# EAGLE design firstTestUno (EAGLE 9.1.3)
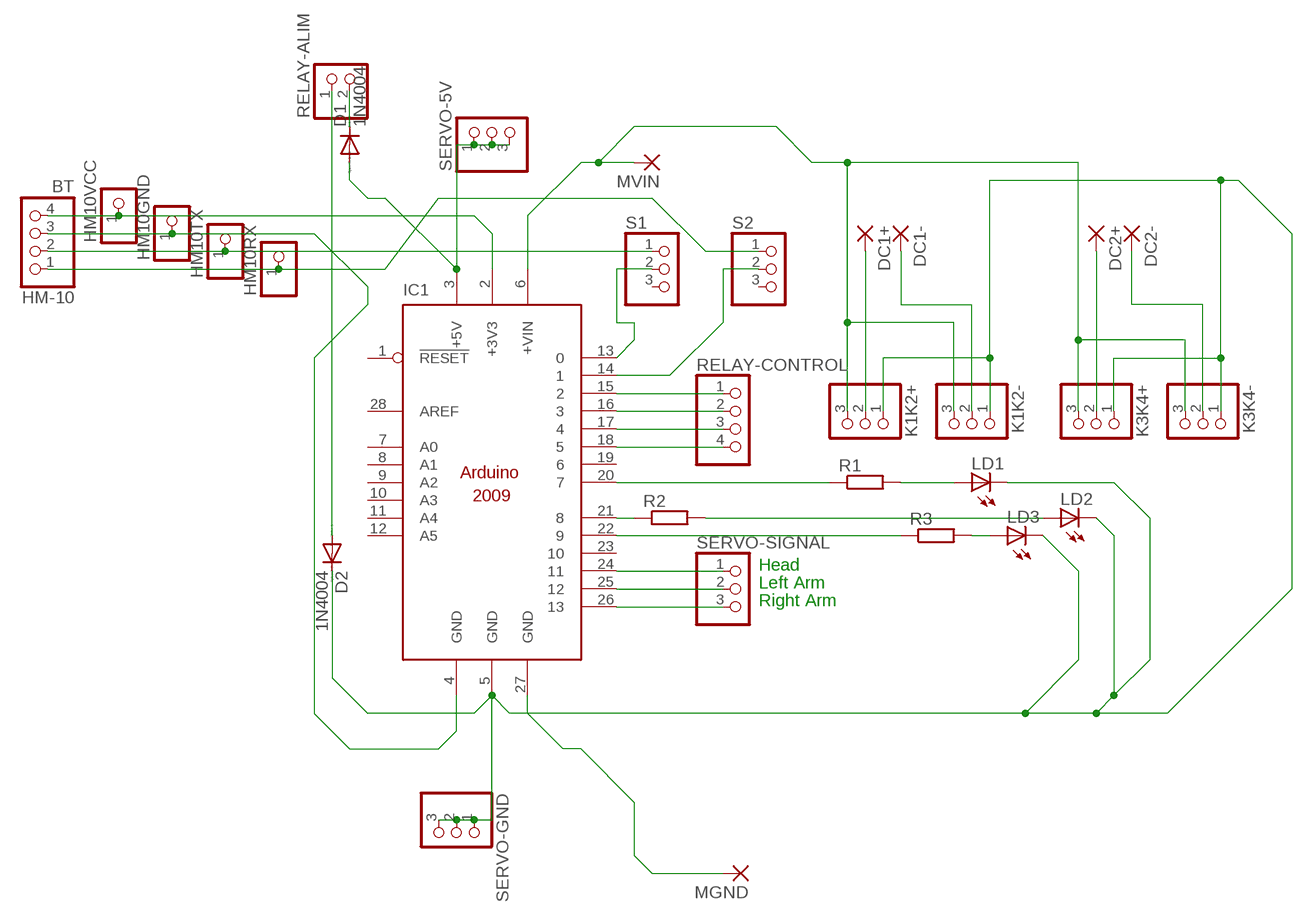
[diagram p0: schematic, sheet 1]

## Parts
D1  1N4004  [DO41-10]
D2  1N4004  [DO41-10]
DC1+  3,17/1,3  [3,17/1,3]
DC1-  3,17/1,3  [3,17/1,3]
DC2+  3,17/1,3  [3,17/1,3]
DC2-  3,17/1,3  [3,17/1,3]
HM10GND  PINHD-1X1  [1X01]
HM10RX  PINHD-1X1  [1X01]
HM10TX  PINHD-1X1  [1X01]
HM10VCC  PINHD-1X1  [1X01]
HM-10  BT  PINHD-1X4  [1X04]
IC1  ARDUINO2009_10  [ARDUINO2009]
K1K2+  PINHD-1X3/90  [1X03/90]
K1K2-  PINHD-1X3/90  [1X03/90]
K3K4+  PINHD-1X3/90  [1X03/90]
K3K4-  PINHD-1X3/90  [1X03/90]
LD1  LED3MM  [LED3MM]
LD2  LED3MM  [LED3MM]
LD3  LED3MM  [LED3MM]
MGND  3,17/1,3  [3,17/1,3]
MVIN  3,17/1,3  [3,17/1,3]
R1  R-EU_0207/10  [0207/10]
R2  R-EU_0207/10  [0207/10]
R3  R-EU_0207/10  [0207/10]
RELAY-ALIM  PINHD-1X2  [1X02]
RELAY-CONTROL  PINHD-1X4  [1X04]
S1  PINHD-1X3  [1X03]
S2  PINHD-1X3  [1X03]
SERVO-5V  PINHD-1X3  [1X03]
SERVO-GND  PINHD-1X3  [1X03]
SERVO-SIGNAL  PINHD-1X3  [1X03]

## Nets
N$1: HM10GND.1 HM-10.3 IC1.4(GND)
N$2: HM10VCC.1 HM-10.4 IC1.2(+3V3)
N$3: IC1.13 S1.2
N$4: D1.A IC1.3(+5V) SERVO-5V.1 SERVO-5V.2 SERVO-5V.3
N$5: HM10TX.1 HM-10.2 S1.1
N$6: D1.C RELAY-ALIM.2
N$7: IC1.27(GND) MGND.1(P)
N$8: DC1-.1(P) K1K2-.2
N$9: IC1.26 SERVO-SIGNAL.3
N$10: IC1.25 SERVO-SIGNAL.2
N$11: IC1.24 SERVO-SIGNAL.1
N$12: IC1.15 RELAY-CONTROL.1
N$13: IC1.16 RELAY-CONTROL.2
N$14: IC1.17 RELAY-CONTROL.3
N$15: IC1.18 RELAY-CONTROL.4
N$16: D2.A RELAY-ALIM.1
N$17: IC1.20 R1.1
N$18: DC1+.1(P) K1K2+.2
N$19: IC1.14 S2.2
N$20: HM10RX.1 HM-10.1 S2.1
N$21: LD1.A R1.2
N$22: DC2-.1(P) K3K4-.2
N$24: LD2.A R2.2
N$25: LD3.A R3.2
N$26: IC1.22 R3.1
N$27: IC1.21 R2.1
N$28: DC2+.1(P) K3K4+.2
N$31: D2.C IC1.5(GND) K1K2+.1 K1K2-.1 K3K4+.1 K3K4-.1 LD1.K(C) LD2.K(C) LD3.K(C) SERVO-GND.1 SERVO-GND.2 SERVO-GND.3
N$32: IC1.6(+VIN) K1K2+.3 K1K2-.3 K3K4+.3 K3K4-.3 MVIN.1(P)
Unconnected: IC1.1(!RESET) IC1.7(A0) IC1.8(A1) IC1.9(A2) IC1.10(A3) IC1.11(A4) IC1.12(A5) IC1.19 IC1.23 IC1.28(AREF) S1.3 S2.3

## Notes on the sheet
- Head
- Left Arm
- Right Arm

## Library data of the parts
D1 = diode:1N4004: DIODE general purpose rectifier, 1 A; MF: MULTICOMP; MPN: 1N4004+; OC_FARNELL: 2675015
D2 = diode:1N4004: DIODE general purpose rectifier, 1 A
DC1+ DC1- DC2+ DC2- MGND MVIN = wirepad:3,17/1,3: THROUGH-HOLE PAD
HM10GND HM10RX HM10TX HM10VCC = pinhead:PINHD-1X1: PIN HEADER
HM-10 RELAY-CONTROL = pinhead:PINHD-1X4: PIN HEADER; OC_FARNELL: unknown
IC1 = arduino:ARDUINO2009_1: The Arduino Duemilanove ("2009") is a microcontroller board based on the ATmega168 or ATmega328. - 14 digital input/output pins (of which 6 can be used as PWM outputs) - 6 analog inputs, a 16 MHz crystal oscillator - USB connection - power jack - ISP header - reset button It contains everything needed to support the microcontroller; simply connect it to a computer with a USB cable or power it with a AC-to-DC adapter or battery to get started http://arduino.cc/en/Main/ArduinoBoardDuemilanove; OC_FARNELL: unknown
K1K2+ K1K2- K3K4+ K3K4- = pinhead:PINHD-1X3: PIN HEADER; OC_FARNELL: unknown
LD1-LD3 = led:LED: LED OSRAM: - CHIPLED LG R971, LG N971, LY N971, LG Q971, LY Q971, LO R971, LY R971 LH N974, LH R974 LS Q976, LO Q976, LY Q976 LO Q996 - Hyper CHIPLED LW Q18S LB Q993, LB Q99A, LB R99A - SideLED LS A670, LO A670, LY A670, LG A670, LP A670 LB A673, LV A673, LT A673, LW A673 LH A674 LY A675 LS A676, LA A676, LO A676, LY A676, LW A676 LS A679, LY A679, LG A679 - Hyper Micro SIDELED® LS Y876, LA Y876, LO Y876, LY Y876 LT Y87S - SmartLED LW L88C, LW L88S LB L89C, LB L89S, LG L890 LS L89K, LO L89K, LY L89K LS L896, LA L896, LO L896, LY L896 - TOPLED LS T670, LO T670, LY T670, LG T670, LP T670 LSG T670, LSP T670, LSY T670, LOP T670, LYG T670 LG T671, LOG T671, LSG T671 LB T673, LV T673, LT T673, LW T673 LH T674 LS T676, LA T676, LO T676, LY T676, LB T676, LH T676, LSB T676, LW T676 LB T67C, LV T67C, LT T67C, LS T67K, LO T67K, LY T67K, LW E67C LS E67B, LA E67B, LO E67B, LY E67B, LB E67C, LV E67C, LT E67C LW T67C LS T679, LY T679, LG T679 LS T770, LO T770, LY T770, LG T770, LP T770 LB T773, LV T773, LT T773, LW T773 LH T774 LS E675, LA E675, LY E675, LS T675 LS T776, LA T776, LO T776, LY T776, LB T776 LHGB T686 LT T68C, LB T68C - Hyper Mini TOPLED® LB M676 - Mini TOPLED Santana® LG M470 LS M47K, LO M47K, LY M47K Source: http://www.osram.convergy.de/; MF: MULTICOMP; MPN: LED 2F; OC_FARNELL: 9555420
R1-R3 = resistor:R-EU_: RESISTOR, European symbol
RELAY-ALIM = pinhead:PINHD-1X2: PIN HEADER; MF: EPCOS; MPN: B65659F0001X023; OC_FARNELL: 2673418
S1 S2 SERVO-5V SERVO-GND = pinhead:PINHD-1X3: PIN HEADER
SERVO-SIGNAL = pinhead:PINHD-1X3: PIN HEADER; MF: TE CONNECTIVITY; MPN: V23234A0001X038-EV-144; OC_FARNELL: 2085455

## Net classes
0 default: width 0.254 mm, drill 0.5 mm
1 Top: width 0.102 mm, clearance 0.025 mm

## Board
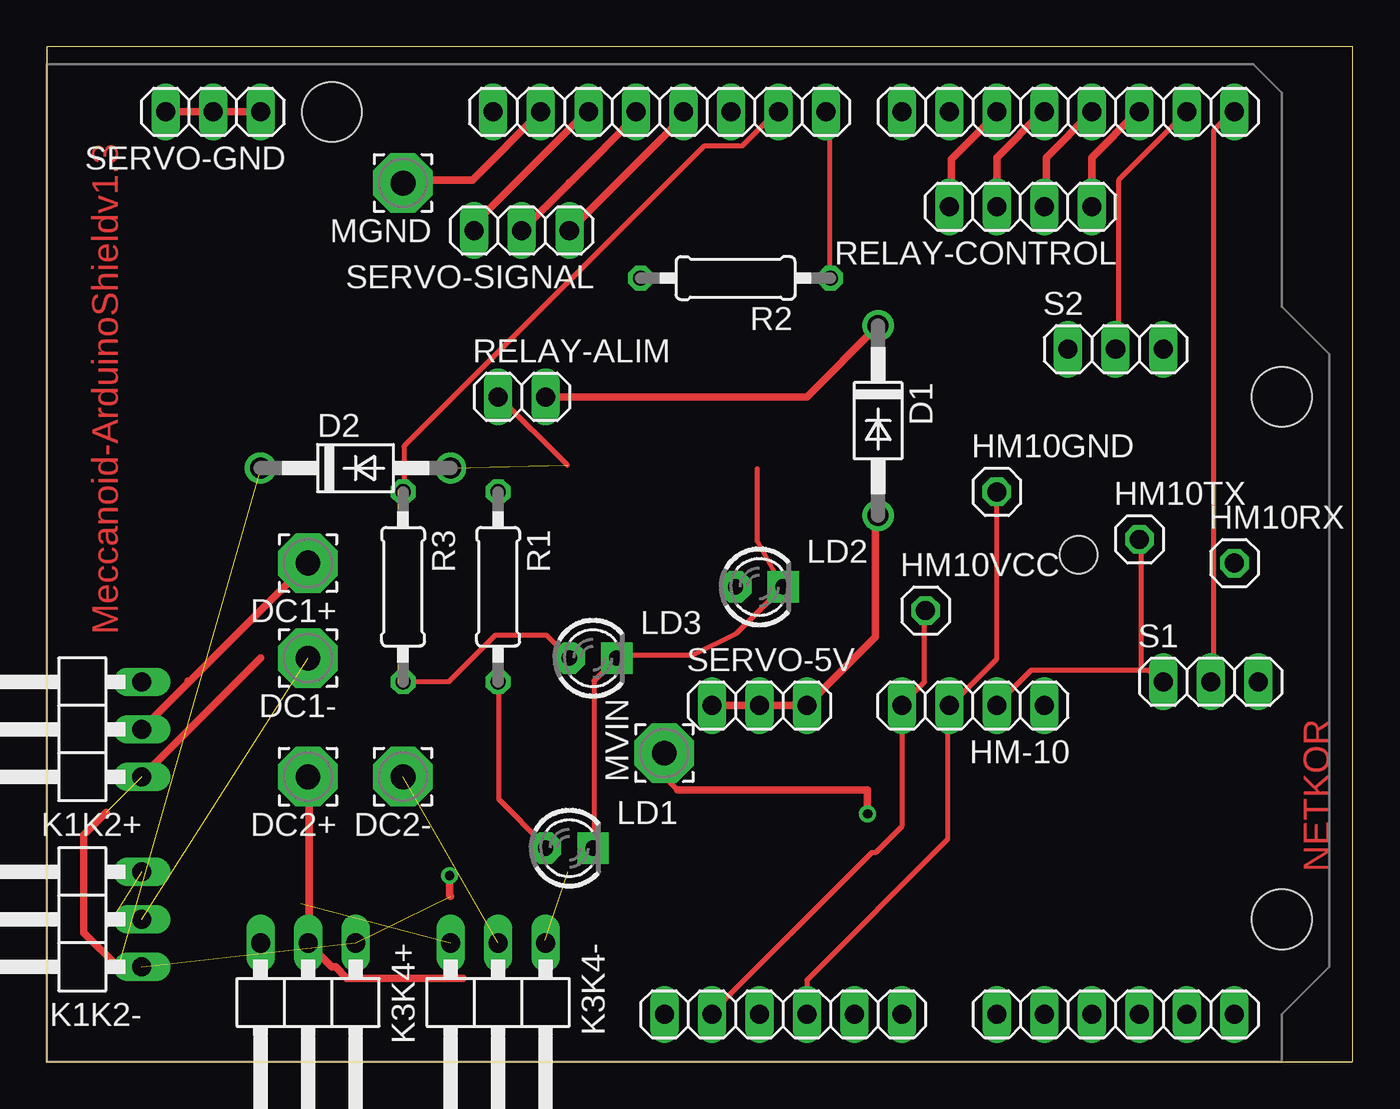
[diagram p1: board, top side]
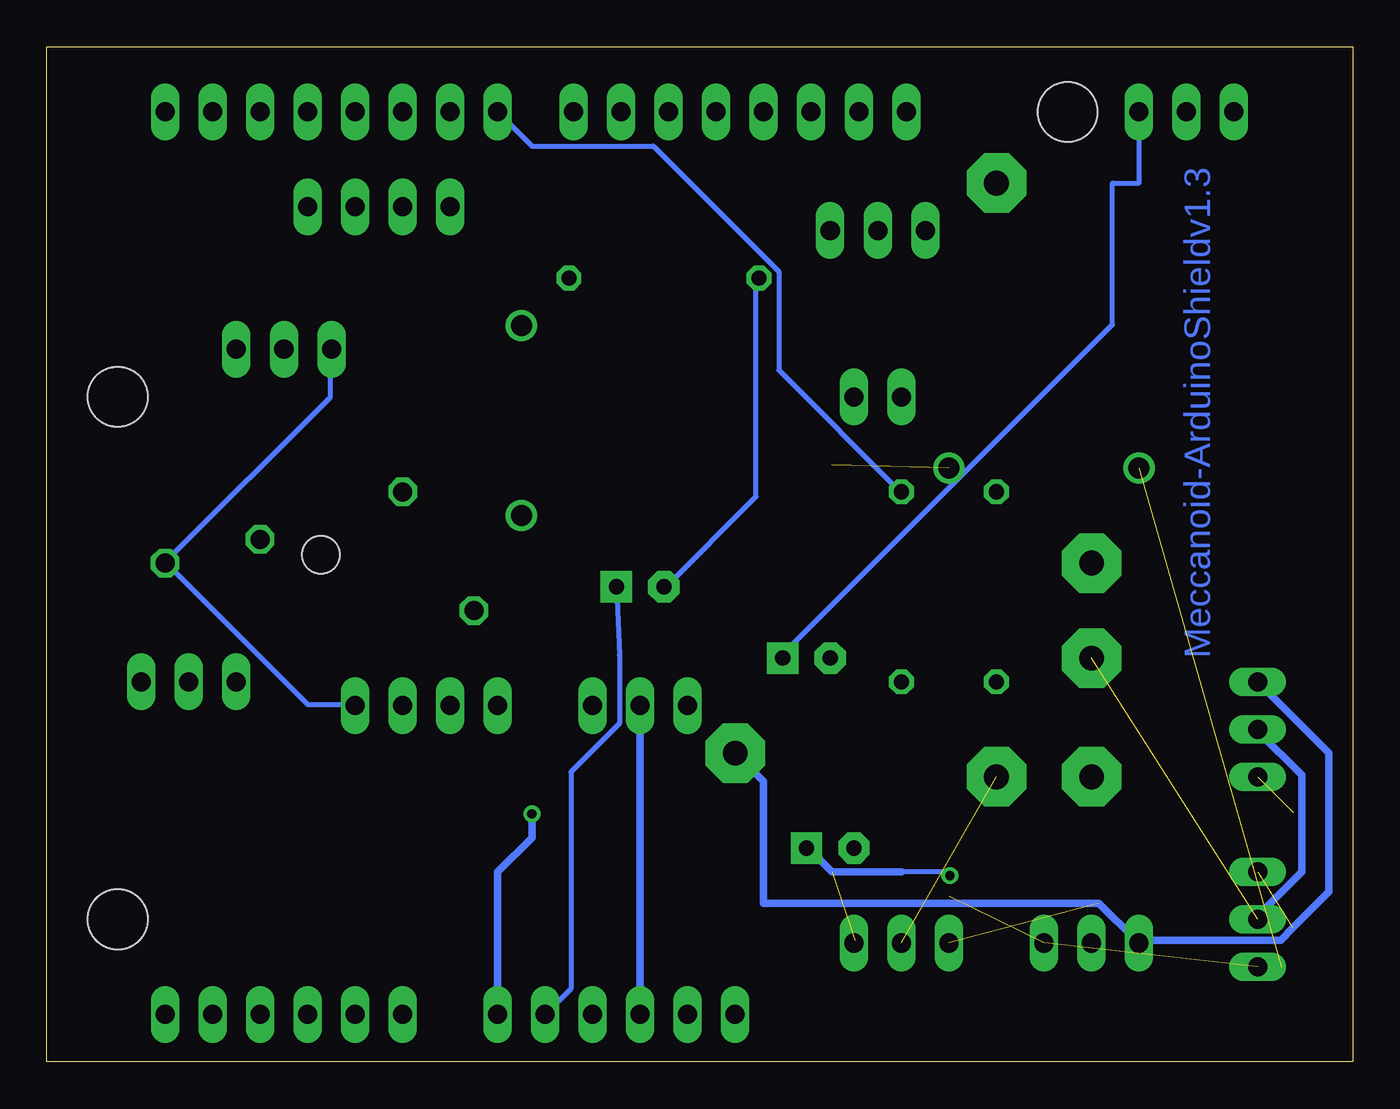
[diagram p2: board, bottom side, seen from below]

Size 69.83 x 54.28 mm. Coordinates in mm from the lower left corner, seen from the top.
Outline: 0,0 69.83,0 69.83,54.28 0,54.28 0,0
Copper layers (1*16): Top 0.035mm / dielectric 1.5mm / Bottom 0.035mm
Design rules "default": minimum track width 6mil, minimum drill 0.35mm, track to track 6mil, track to pad 6mil, pad to pad 6mil, via to via 6mil, smd to smd 6mil, copper to edge 40mil, drill to drill 6mil, minimum pad ring 10mil, minimum via ring 8mil, stop-mask expansion 4mil, vias tented up to drill 0mil, thermal gap 10mil

### Footprints (pad centres in the part's own frame; a part is rotated, then mirrored left to right if it is on the bottom)
DO41-10 = drill 1.118: A 5.08,0; C -5.08,0
3,17/1,3 = drill 1.321 pad 3.175 octagon: 1 0,0
1X01 = drill 1.016 octagon: 1 0,0
1X04 = drill 1.016 long: 1 -3.81,0; 2 -1.27,0; 3 1.27,0; 4 3.81,0
ARDUINO2009 = drill 1.016 long: 1 33.02,2.54; 2 35.56,2.54; 3 38.1,2.54; 4 40.64,2.54; 5 43.18,2.54; 6 45.72,2.54; 7 50.8,2.54; 8 53.34,2.54; 9 55.88,2.54; 10 58.42,2.54; 11 60.96,2.54; 12 63.5,2.54; 13 63.5,50.8; 14 60.96,50.8; 15 58.42,50.8; 16 55.88,50.8; 17 53.34,50.8; 18 50.8,50.8; 19 48.26,50.8; 20 45.72,50.8; 21 41.656,50.8; 22 39.116,50.8; 23 36.576,50.8; 24 34.036,50.8; 25 31.496,50.8; 26 28.956,50.8; 27 26.416,50.8; 28 23.876,50.8 | hole 3.2: 15.24,50.8; 66.04,35.56; 66.04,7.62 | hole 2: 55.17,27.114
1X03/90 = drill 1.016 long: 1 -2.54,-3.81; 2 0,-3.81; 3 2.54,-3.81
LED3MM = drill 0.813 pad 1.676 octagon: A -1.27,0 | drill 0.813 pad 1.676 square: K 1.27,0
0207/10 = drill 0.813 octagon: 1 -5.08,0; 2 5.08,0
1X02 = drill 1.016 long: 1 -1.27,0; 2 1.27,0
1X03 = drill 1.016 long: 1 -2.54,0; 2 0,0; 3 2.54,0

### Placement (x,y rotation side)
D1  44.45,34.29 270 top
D2  16.51,31.75 0 top
DC1+  13.97,26.67 180 top
DC1-  13.97,21.59 180 top
DC2+  13.97,15.24 180 top
DC2-  19.05,15.24 180 top
HM10GND  50.8,30.48 0 top
HM10RX  63.5,26.67 0 top
HM10TX  58.42,27.94 0 top
HM10VCC  46.99,24.13 0 top
HM-10  49.53,19.05 180 top
IC1  0,0 0 top
K1K2+  1.27,17.78 90 top
K1K2-  1.27,7.62 90 top
K3K4+  13.97,2.54 180 top
K3K4-  24.13,2.54 180 top
LD1  27.94,11.43 0 top
LD2  38.1,25.4 0 top
LD3  29.21,21.59 0 top
MGND  19.05,46.99 180 top
MVIN  33.02,16.51 90 top
R1  24.13,25.4 270 top
R2  36.83,41.91 180 top
R3  19.05,25.4 270 top
RELAY-ALIM  25.4,35.56 0 top
RELAY-CONTROL  52.07,45.72 180 top
S1  62.23,20.32 0 top
S2  57.15,38.1 0 top
SERVO-5V  38.1,19.05 0 top
SERVO-GND  8.89,50.8 180 top
SERVO-SIGNAL  25.4,44.45 180 top

### Tracks (layer width: path | path; a pad name or v marks a point on that pad's centre or on a via)
N$1
  Top 0.254: IC1.4 40.64,4.37 48.16,11.89 48.16,18.9 HM-10.3 48.36,19.1 50.8,21.54 HM10GND.1
N$2
  Top 0.254: IC1.2 35.56,2.64 44.09,11.18 44.3,11.18 45.72,12.6 HM-10.4 45.72,19.1 46.94,20.32 46.94,24.08 HM10VCC.1
N$3
  Top 0.254: S1.2 62.38,20.32 62.38,49.78 63.4,50.8 IC1.13
N$4
  Top 0.254: SERVO-5V.1 35.56,19.1 38,19.1 SERVO-5V.2 38.2,19.1 40.64,19.1 | 40.64,19.1 44.3,22.76 | 40.64,19.1 SERVO-5V.3
  Top 0.406: SERVO-5V.1 38.15,19.05 38.2,19.1 | SERVO-5V.2 40.59,19.05 40.64,19.1 | SERVO-5V.3 44.3,22.71 44.3,22.76 44.3,29.06 D1.A
  Bottom 0.406: IC1.3 SERVO-5V.2
N$5
  Top 0.254: 58.52,20.93 58.93,20.93 59.54,20.32 S1.1 | 58.52,20.93 52.63,20.93 50.8,19.1 HM-10.2 | 58.52,20.93 58.52,27.84 HM10TX.1
N$6
  Top 0.406: D1.C 40.64,35.56 RELAY-ALIM.2
N$7
  Top 0.406: MGND.1 19.2,47.14 22.76,47.14 IC1.27
N$8  (1 unrouted)
N$9
  Top 0.254: IC1.26 28.85,50.8
  Top 0.406: SERVO-SIGNAL.3 22.86,44.81 28.85,50.8
N$10
  Top 0.254: 27.91,47.02 31.5,50.6 IC1.25
  Top 0.406: SERVO-SIGNAL.2 27.91,46.97 | 27.91,46.97 27.91,47.02 | 27.91,46.97 31.75,50.8
N$11
  Top 0.406: IC1.24 34.04,50.55 SERVO-SIGNAL.1
N$12
  Top 0.254: 58.32,50.8 IC1.15
  Top 0.406: RELAY-CONTROL.1 55.88,48.36 58.32,50.8
N$13
  Top 0.406: RELAY-CONTROL.2 53.44,45.82 53.44,48.36 IC1.16
N$14
  Top 0.406: RELAY-CONTROL.3 50.8,48.36 53.24,50.8 IC1.17
N$15
  Top 0.406: RELAY-CONTROL.4 48.36,45.82 48.36,48.26 50.8,50.7 IC1.18
N$16  (1 unrouted)
  Top 0.254: 27.84,31.9 24.18,35.56 RELAY-ALIM.1
N$17
  Bottom 0.254: IC1.20 43.89,48.97 37.39,48.97 30.68,42.27 30.68,36.98 24.18,30.48 R1.1
N$18
  Top 0.406: DC1+.1 7.67,20.37 7.57,20.37 7.57,20.27 K1K2+.2
  Bottom 0.254: 5.08,17.68 K1K2+.2
  Bottom 0.406: 5.08,17.68 2.74,15.34 2.74,10.16 5.08,7.82
N$19
  Top 0.254: IC1.14 57.3,47.14 57.3,38.2 S2.2
N$20
  Bottom 0.254: HM-10.1 53.44,19.1 55.88,19.1 63.4,26.62 HM10RX.1 63.4,26.82 54.66,35.56 54.66,38 S2.1
N$21
  Top 0.254: R1.2 24.18,20.32 24.18,14.02 26.62,11.58 LD1.A
N$22  (1 unrouted)
N$24
  Bottom 0.254: R2.2 31.9,41.86 31.9,30.23 36.73,25.4 LD2.A
N$25
  Top 0.254: R3.2 21.49,20.32 23.98,22.81 26.72,22.81 LD3.A
N$26
  Top 0.254: R3.1 19.1,30.48 19.1,32.92 35.15,48.97 37.19,48.97 39.01,50.8 IC1.22
N$27
  Top 0.254: IC1.21 41.86,50.6 41.86,42.06 R2.1
N$28
  Top 0.254: 14.02,6.5 K3K4+.2 | DC2+.1 14.02,15.14
  Top 0.406: 14.02,15.14 14.02,6.5 | 22.25,4.47 16.05,4.47 15.44,5.08 15.24,5.08 K3K4+.2
N$31  (via drill 0.5)  (5 unrouted)
  Top 0.254: 26.62,6.5 K3K4-.1 | SERVO-GND.3 SERVO-GND.2 10.16,50.8 | 38,31.7 38,27.84 LD2.K 36.88,22.91 34.49,21.74 30.53,21.74 LD3.K 29.26,20.37 29.26,11.58 LD1.K
  Top 0.406: 3.17,13.34 1.98,12.14 1.98,6.91 3.81,5.08 K1K2-.1 | K1K2+.1 11.43,21.59 | 21.59,8.84 21.54,8.89 v21.54,9.96 | SERVO-GND.3 10.16,50.8 SERVO-GND.1
  Bottom 0.254: 24.13,10.16 21.54,10.16 v21.54,9.96 | LD2.K 39.22,21.74 39.22,18.09 41.81,15.49 41.81,3.91 IC1.5 | SERVO-GND.1 11.43,46.99 12.85,46.99 12.85,39.42 30.68,21.59 LD3.K
  Bottom 0.406: 24.13,10.16 27.84,10.16 29.11,11.43 LD1.K
N$32  (via drill 0.5)  (2 unrouted)
  Top 0.254: 33.73,14.53 33.02,15.24 MVIN.1
  Top 0.406: v43.89,13.26 43.89,14.53 33.73,14.53
  Bottom 0.254: 3.86,6.5 11.38,6.5 K3K4+.3 13.56,8.48
  Bottom 0.406: IC1.6 45.72,10.16 43.89,11.99 v43.89,13.26 | MVIN.1 31.5,14.99 31.5,8.48 13.56,8.48 11.58,6.5 11.38,6.5 | K3K4+.3 11.28,6.5 3.86,6.5 3.85,6.5 3.2,7.16 1.27,9.09 1.27,16.51 K1K2+.3

### Text on the board
Top: Meccanoid-ArduinoShieldv1.3 | NETKOR
Bottom: Meccanoid-ArduinoShieldv1.3